# Altium schematic sheet Ind_current_sensor_VW.SchDoc
size 304 x 482 mm
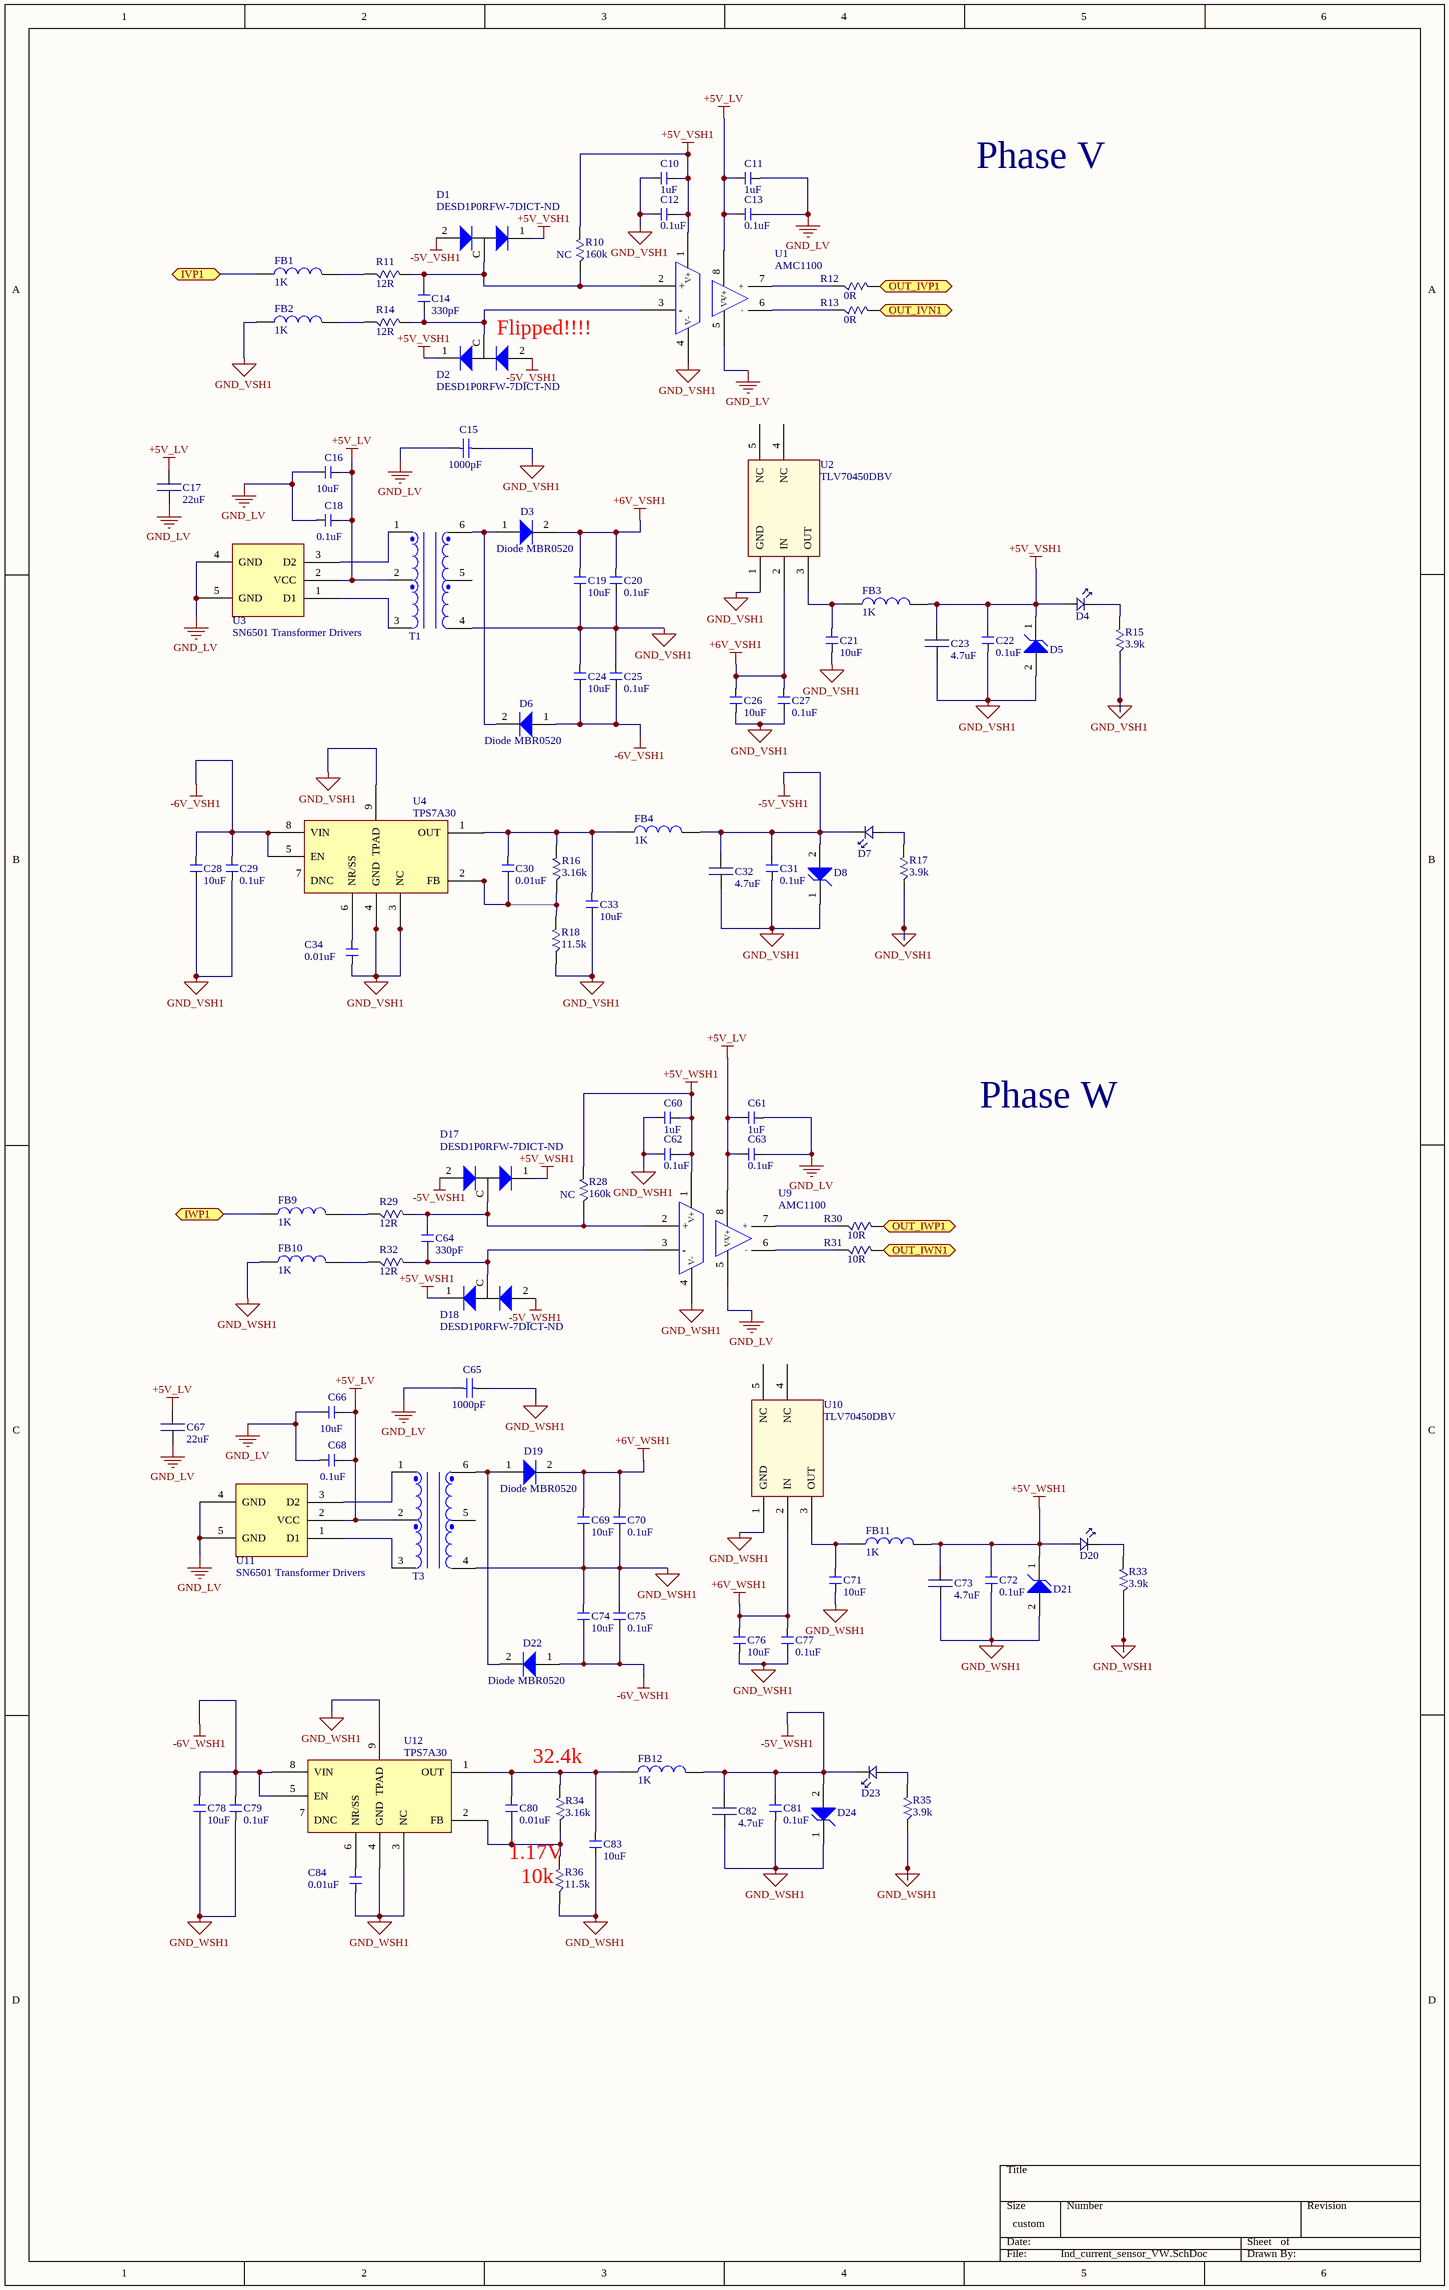
[diagram p0: Ind_current_sensor_VW.SchDoc]

## Parts
C10  value 1uF  [0603 (1608 Metric)]  (hidden comment: Cap 0603_new)
C11  value 1uF  [0603 (1608 Metric)]  (hidden comment: Cap 0603_new)
C12  value 0.1uF  [0603 (1608 Metric)]  (hidden comment: Cap 0603_new)
C13  value 0.1uF  [0603 (1608 Metric)]  (hidden comment: Cap 0603_new)
C14  value 330pF  [0603 (1608 Metric)]  (hidden comment: Cap 0603_new)
C15  value 1000pF  [RAD-0.3]  (hidden comment: Cap TH)
C16  value 10uF  [0603 (1608 Metric)]  (hidden comment: Cap 0603_new)
C17  value 22uF  [0805 (2012 metric)]  (hidden comment: Cap 0805)
C18  value 0.1uF  [0603 (1608 Metric)]  (hidden comment: Cap 0603_new)
C19  value 10uF  [0603 (1608 Metric)]  (hidden comment: Cap 0603_new)
C20  value 0.1uF  [0603 (1608 Metric)]  (hidden comment: Cap 0603_new)
C21  value 10uF  [0603 (1608 Metric)]  (hidden comment: Cap 0603_new)
C22  value 0.1uF  [0603 (1608 Metric)]  (hidden comment: Cap 0603_new)
C23  value 4.7uF  [0805 (2012 metric)]  (hidden comment: Cap 0805)
C24  value 10uF  [0603 (1608 Metric)]  (hidden comment: Cap 0603_new)
C25  value 0.1uF  [0603 (1608 Metric)]  (hidden comment: Cap 0603_new)
C26  value 10uF  [0603 (1608 Metric)]  (hidden comment: Cap 0603_new)
C27  value 0.1uF  [0603 (1608 Metric)]  (hidden comment: Cap 0603_new)
C28  value 10uF  [0603 (1608 Metric)]  (hidden comment: Cap 0603_new)
C29  value 0.1uF  [0603 (1608 Metric)]  (hidden comment: Cap 0603_new)
C30  value 0.01uF  [0603 (1608 Metric)]  (hidden comment: Cap 0603_new)
C31  value 0.1uF  [0603 (1608 Metric)]  (hidden comment: Cap 0603_new)
C32  value 4.7uF  [0805 (2012 metric)]  (hidden comment: Cap 0805)
C33  value 10uF  [0603 (1608 Metric)]  (hidden comment: Cap 0603_new)
C34  value 0.01uF  [0603 (1608 Metric)]  (hidden comment: Cap 0603_new)
C60  value 1uF  [0603 (1608 Metric)]  (hidden comment: Cap 0603_new)
C61  value 1uF  [0603 (1608 Metric)]  (hidden comment: Cap 0603_new)
C62  value 0.1uF  [0603 (1608 Metric)]  (hidden comment: Cap 0603_new)
C63  value 0.1uF  [0603 (1608 Metric)]  (hidden comment: Cap 0603_new)
C64  value 330pF  [0603 (1608 Metric)]  (hidden comment: Cap 0603_new)
C65  value 1000pF  [RAD-0.3]  (hidden comment: Cap TH)
C66  value 10uF  [0603 (1608 Metric)]  (hidden comment: Cap 0603_new)
C67  value 22uF  [0805 (2012 metric)]  (hidden comment: Cap 0805)
C68  value 0.1uF  [0603 (1608 Metric)]  (hidden comment: Cap 0603_new)
C69  value 10uF  [0603 (1608 Metric)]  (hidden comment: Cap 0603_new)
C70  value 0.1uF  [0603 (1608 Metric)]  (hidden comment: Cap 0603_new)
C71  value 10uF  [0603 (1608 Metric)]  (hidden comment: Cap 0603_new)
C72  value 0.1uF  [0603 (1608 Metric)]  (hidden comment: Cap 0603_new)
C73  value 4.7uF  [0805 (2012 metric)]  (hidden comment: Cap 0805)
C74  value 10uF  [0603 (1608 Metric)]  (hidden comment: Cap 0603_new)
C75  value 0.1uF  [0603 (1608 Metric)]  (hidden comment: Cap 0603_new)
C76  value 10uF  [0603 (1608 Metric)]  (hidden comment: Cap 0603_new)
C77  value 0.1uF  [0603 (1608 Metric)]  (hidden comment: Cap 0603_new)
C78  value 10uF  [0603 (1608 Metric)]  (hidden comment: Cap 0603_new)
C79  value 0.1uF  [0603 (1608 Metric)]  (hidden comment: Cap 0603_new)
C80  value 0.01uF  [0603 (1608 Metric)]  (hidden comment: Cap 0603_new)
C81  value 0.1uF  [0603 (1608 Metric)]  (hidden comment: Cap 0603_new)
C82  value 4.7uF  [0805 (2012 metric)]  (hidden comment: Cap 0805)
C83  value 10uF  [0603 (1608 Metric)]  (hidden comment: Cap 0603_new)
C84  value 0.01uF  [0603 (1608 Metric)]  (hidden comment: Cap 0603_new)
D1  Part: DESD1P0RFW-7DICT-ND  [SOT323_ESD]  (hidden comment: TVS - Diodes)
D2  Part: DESD1P0RFW-7DICT-ND  [SOT323_ESD]  (hidden comment: TVS - Diodes)
D3  Diode MBR0520  [SOD-123]
D4  LED  [0805 (2012 Metric) Diode]  (value not drawn)
D5  *  [POWERDI]  (value not drawn)
D6  Diode MBR0520  [SOD-123]
D7  LED  [0805 (2012 Metric) Diode]  (value not drawn)
D8  *  [POWERDI]  (value not drawn)
D17  Part: DESD1P0RFW-7DICT-ND  [SOT323_ESD]  (hidden comment: TVS - Diodes)
D18  Part: DESD1P0RFW-7DICT-ND  [SOT323_ESD]  (hidden comment: TVS - Diodes)
D19  Diode MBR0520  [SOD-123]
D20  LED  [0805 (2012 Metric) Diode]  (value not drawn)
D21  *  [POWERDI]  (value not drawn)
D22  Diode MBR0520  [SOD-123]
D23  LED  [0805 (2012 Metric) Diode]  (value not drawn)
D24  *  [POWERDI]  (value not drawn)
FB1  value 1K  [0603 (1608 Metric)]  (hidden comment: Ferrite bead)
FB2  value 1K  [0603 (1608 Metric)]  (hidden comment: Ferrite bead)
FB3  value 1K  [0603 (1608 Metric)]  (hidden comment: Ferrite bead)
FB4  value 1K  [0603 (1608 Metric)]  (hidden comment: Ferrite bead)
FB9  value 1K  [0603 (1608 Metric)]  (hidden comment: Ferrite bead)
FB10  value 1K  [0603 (1608 Metric)]  (hidden comment: Ferrite bead)
FB11  value 1K  [0603 (1608 Metric)]  (hidden comment: Ferrite bead)
FB12  value 1K  [0603 (1608 Metric)]  (hidden comment: Ferrite bead)
R10  NC  value 160k  [0603 (1608 Metric)]
R11  value 12R  [1206]  (hidden comment: Resistor 1206)
R12  value 0R  [0603 (1608 Metric)]  (hidden comment: Resistor 0603)
R13  value 0R  [0603 (1608 Metric)]  (hidden comment: Resistor 0603)
R14  value 12R  [1206]  (hidden comment: Resistor 1206)
R15  value 3.9k  [0603 (1608 Metric)]  (hidden comment: Resistor 0603)
R16  value 3.16k  [0603 (1608 Metric)]  (hidden comment: Resistor 0603)
R17  value 3.9k  [0603 (1608 Metric)]  (hidden comment: Resistor 0603)
R18  value 11.5k  [0603 (1608 Metric)]  (hidden comment: Resistor 0603)
R28  NC  value 160k  [0603 (1608 Metric)]
R29  value 12R  [1206]  (hidden comment: Resistor 1206)
R30  value 10R  [0603 (1608 Metric)]  (hidden comment: Resistor 0603)
R31  value 10R  [0603 (1608 Metric)]  (hidden comment: Resistor 0603)
R32  value 12R  [1206]  (hidden comment: Resistor 1206)
R33  value 3.9k  [0603 (1608 Metric)]  (hidden comment: Resistor 0603)
R34  value 3.16k  [0603 (1608 Metric)]  (hidden comment: Resistor 0603)
R35  value 3.9k  [0603 (1608 Metric)]  (hidden comment: Resistor 0603)
R36  value 11.5k  [0603 (1608 Metric)]  (hidden comment: Resistor 0603)
T1  750313769  [Xmr SN6501]  (value not drawn)
T3  750313769  [Xmr SN6501]  (value not drawn)
U1  AMC1100  [SOIC8]
U2  TLV70450DBV  [SOT23-5]
U3  SN6501 Transformer Drivers  [SOT23-5]
U4  TPS7A30  [8-TSSOP]
U9  AMC1100  [SOIC8]
U10  TLV70450DBV  [SOT23-5]
U11  SN6501 Transformer Drivers  [SOT23-5]
U12  TPS7A30  [8-TSSOP]

## Ports
IVP1, IWP1, OUT_IVN1, OUT_IVP1, OUT_IWN1, OUT_IWP1

## Nets
+5V_LV: C11.1(OUT) C13.1(OUT) C16.2(OUT) C17.2(OUT) C18.2(OUT) C61.1(OUT) C63.1(OUT) C66.2(OUT) C67.2(OUT) C68.2(OUT) T1.2 T3.2 U1.8(V+) U3.2(VCC) U9.8(V+) U11.2(VCC)
+5V_VSH1: C10.2(OUT) C12.2(OUT) C22.2(OUT) C23.2(OUT) D1.1(Anode) D2.1(Anode) D4.A D5.1(Anode) FB3.2(OUT) R10.2(A) U1.1(V+)
+5V_WSH1: C60.2(OUT) C62.2(OUT) C72.2(OUT) C73.2(OUT) D17.1(Anode) D18.1(Anode) D20.A D21.1(Anode) FB11.2(OUT) R28.2(A) U9.1(V+)
+6V_VSH1: C19.2(OUT) C20.2(OUT) C26.2(OUT) C27.2(OUT) D3.2(Anode) U2.2(IN)
+6V_WSH1: C69.2(OUT) C70.2(OUT) C76.2(OUT) C77.2(OUT) D19.2(Anode) U10.2(IN)
-5V_VSH1: C31.2(OUT) C32.2(OUT) D1.2(Anode) D2.2(Anode) D7.K D8.2(Anode) FB4.2(OUT)
-5V_WSH1: C81.2(OUT) C82.2(OUT) D17.2(Anode) D18.2(Anode) D23.K D24.2(Anode) FB12.2(OUT)
-6V_VSH1: C24.1(OUT) C25.1(OUT) C28.2(OUT) C29.2(OUT) D6.1(Anode) U4.5(EN) U4.8(VIN)
-6V_WSH1: C74.1(OUT) C75.1(OUT) C78.2(OUT) C79.2(OUT) D22.1(Anode) U12.5(EN) U12.8(VIN)
GND_LV: C11.2(OUT) C13.2(OUT) C15.1 C16.1(OUT) C17.1(OUT) C18.1(OUT) C61.2(OUT) C63.2(OUT) C65.1 C66.1(OUT) C67.1(OUT) C68.1(OUT) U1.5(V-) U3.4(GND) U3.5(GND) U9.5(V-) U11.4(GND) U11.5(GND)
GND_VSH1: C10.1(OUT) C12.1(OUT) C15.2 C19.1(OUT) C20.1(OUT) C21.1(OUT) C22.1(OUT) C23.1(OUT) C24.2(OUT) C25.2(OUT) C26.1(OUT) C27.1(OUT) C28.1(OUT) C29.1(OUT) C31.1(OUT) C32.1(OUT) C33.1(OUT) C34.1(OUT) D5.2(Anode) D8.1(Anode) FB2.1(OUT) R15.1(A) R17.1(A) R18.1(A) T1.4 U1.4(V-) U2.1(GND) U4.3(NC) U4.4(GND) U4.9(TPAD)
GND_WSH1: C60.1(OUT) C62.1(OUT) C65.2 C69.1(OUT) C70.1(OUT) C71.1(OUT) C72.1(OUT) C73.1(OUT) C74.2(OUT) C75.2(OUT) C76.1(OUT) C77.1(OUT) C78.1(OUT) C79.1(OUT) C81.1(OUT) C82.1(OUT) C83.1(OUT) C84.1(OUT) D21.2(Anode) D24.1(Anode) FB10.1(OUT) R33.1(A) R35.1(A) R36.1(A) T3.4 U9.4(V-) U10.1(GND) U12.3(NC) U12.4(GND) U12.9(TPAD)
IVP1: FB1.1(OUT) ; port IVP1
IWP1: FB9.1(OUT) ; port IWP1
OUT_IVN1: R13.2(A) ; port OUT_IVN1
OUT_IVP1: R12.2(A) ; port OUT_IVP1
OUT_IWN1: R31.2(A) ; port OUT_IWN1
OUT_IWP1: R30.2(A) ; port OUT_IWP1
NetC14_1: C14.1(OUT) D1.C(Cathode) R10.1(A) R11.2(A) U1.2(+)
NetC14_2: C14.2(OUT) D2.C(Cathode) R14.2(A) U1.3(-)
NetC21_2: C21.2(OUT) FB3.1(OUT) U2.3(OUT)
NetC30_1: C30.1(OUT) C33.2(OUT) FB4.1(OUT) R16.2(A) U4.1(OUT)
NetC30_2: C30.2(OUT) R16.1(A) R18.2(A) U4.2(FB)
NetC34_2: C34.2(OUT) U4.6(NR/SS)
NetC64_1: C64.1(OUT) D17.C(Cathode) R28.1(A) R29.2(A) U9.2(+)
NetC64_2: C64.2(OUT) D18.C(Cathode) R32.2(A) U9.3(-)
NetC71_2: C71.2(OUT) FB11.1(OUT) U10.3(OUT)
NetC80_1: C80.1(OUT) C83.2(OUT) FB12.1(OUT) R34.2(A) U12.1(OUT)
NetC80_2: C80.2(OUT) R34.1(A) R36.2(A) U12.2(FB)
NetC84_2: C84.2(OUT) U12.6(NR/SS)
NetD3_1: D3.1(Anode) D6.2(Anode) T1.6
NetD4_K: D4.K R15.2(A)
NetD7_A: D7.A R17.2(A)
NetD19_1: D19.1(Anode) D22.2(Anode) T3.6
NetD20_K: D20.K R33.2(A)
NetD23_A: D23.A R35.2(A)
NetFB1_2: FB1.2(OUT) R11.1(A)
NetFB2_2: FB2.2(OUT) R14.1(A)
NetFB9_2: FB9.2(OUT) R29.1(A)
NetFB10_2: FB10.2(OUT) R32.1(A)
NetR12_1: R12.1(A) U1.7(+)
NetR13_1: R13.1(A) U1.6(-)
NetR30_1: R30.1(A) U9.7(+)
NetR31_1: R31.1(A) U9.6(-)
NetT1_1: T1.1 U3.3(D2)
NetT1_3: T1.3 U3.1(D1)
NetT3_1: T3.1 U11.3(D2)
NetT3_3: T3.3 U11.1(D1)

Not connected (* = marked no-connect by the designer): T1 5(1); T3 5(1); U2 4(NC) 5(NC); U4 7(DNC); U10 4(NC) 5(NC); U12 7(DNC)

## Notes on the sheet
- Phase V
- (near D2) Flipped!!!!
- Phase W
- 32.4k
- (near R36) 1.17V
- (near R36) 10k

## Library data of the parts
C10 C11 C60 C61 = Cap 0603_new: CAP CER 1UF 50V X5R 0603; part: 1276-1860-1-ND
C12 C13 C18 C20 C22 C25 C27 C29 C31 C62 C63 C68 C70 C72 C75 C77 C79 C81 = Cap 0603_new: CAP CER 0.1UF 50V Y5V 0603; part: 311-1343-6-ND
C14 C64 = Cap 0603_new: CAP CER 330PF 50V C0G 0603; part: 445-7033-2-ND
C15 C65 = Cap: CAP CER 1000PF 1KV Y5P RADIAL; Part: 1251PH-ND; Published: 8-Jun-2000; LatestRevisionDate: 17-Jul-2002; LatestRevisionNote: Re-released for DXP Platform.; PackageReference: RAD-0.3; Publisher: Altium Limited; PackageDescription: Radial Cap, Thru-Hole; 2 Leads; 0.3 in Pin Spacing
C16 C19 C21 C24 C26 C28 C33 C66 C69 C71 C74 C76 C78 C83 = Cap 0603_new: CAP CER 10UF 35V X5R 0805; part: 490-10515-1-ND
C17 C67 = Cap 0805: CAP CER 22UF 35V X5R 0805; Part: 445-14428-1-ND
C23 C32 C73 C82 = Cap 0805: CAP CER 4.7UF 50V X5R 0805; Part: 445-5980-1-ND
C30 C34 C80 C84 = Cap 0603_new: CAP CER 10000PF 100V X7R 0603; part: 478-7418-1-ND
D1 D2 D17 D18 = Diode_ESD: TVS DIODE 70VWM 8VC SOT323; Value: ESD
D3 D6 D19 D22 = Diode MBR0520: DIODE SCHOTTKY 20V 500MA SOD123; Part: MBR0520LT1GOSCT-ND; Value: *
D4 D7 D20 D23 = LED: LED 0805
D5 D8 D21 D24 = Diode Zener POWERDI123: Part: MMSZ5228B-FDICT-ND; Value: *
FB1-FB4 FB9-FB12 = Ferrite bead: FERRITE BEAD 1 KOHM 0603 1LN; Part: 445-8672-1-ND
R10 R28 = Resistor 0603
R11 R14 R29 R32 = Resistor 1206: 12 Ohm ±0.5% 0.25W, 1/4W Chip Resistor 1206; Part: 311-2961-1-ND
R12 R13 R30 R31 = Resistor 0603: RES SMD 10 OHM 0.05% 1/10W 0603; Part: RNCF0603AKT10R0CT-ND
R15 R17 R33 R35 = Resistor 0603: RES SMD 3.9K OHM 5% 1/10W 0603; Part: 541-3.9KGCT-ND
R16 R34 = Resistor 0603: RES SMD 3.16K OHM 1% 1/10W 0603; Part: 311-3.16KHRCT-ND
R18 R36 = Resistor 0603: RES SMD 11.5K OHM 1% 1/10W 0603; Part: 541-11.5KHCT-ND
T1 T3 = 750313769: TRANSFORMER SMD TR1.7 SN6501; Part: 1297-1107-1-ND
U1 U9 = AMC1100: IC OPAMP ISOLATION 100KHZ 8SOIC; Part: 296-38822-5-ND
U2 U10 = TLV70450DBV: IC REG LDO 5V 0.15A SOT23-5; Part: 296-39287-1-ND
U3 U11 = SN6501: IC REG CONV PWR SUPPLIES SOT23-5; Part: 296-37700-1-ND; Value: *
U4 U12 = TPS7A30: IC REG LDO NEG ADJ 0.2A 8MSOP; Part: 296-27750-1-ND